# Altium schematic sheet UART.SchDoc: Air724UG 参考设计
size 594 x 419 mm; DESIGNER: Loukanghua; REV: V1.0
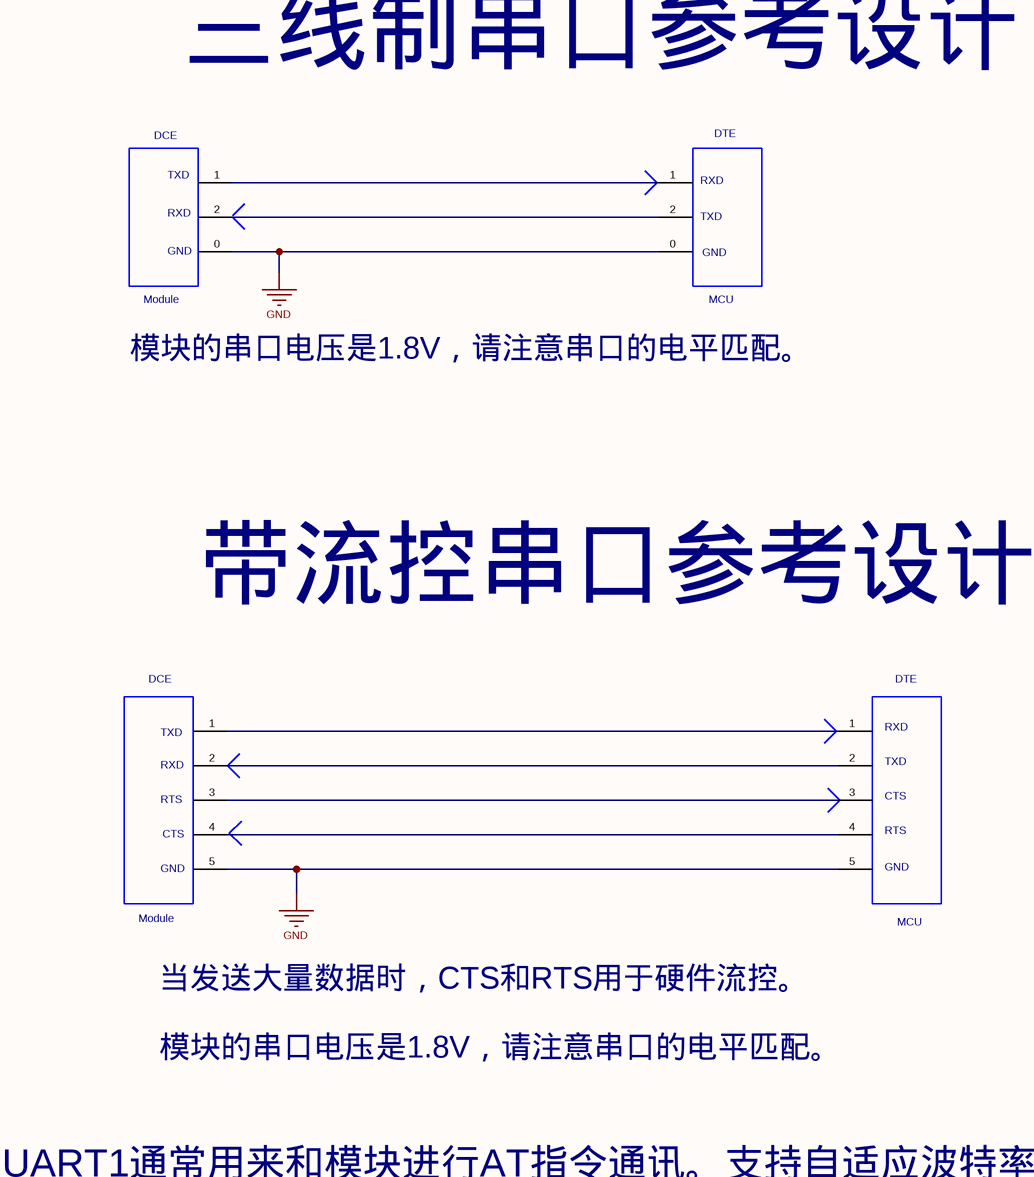
[diagram p0: UART.SchDoc, top left]
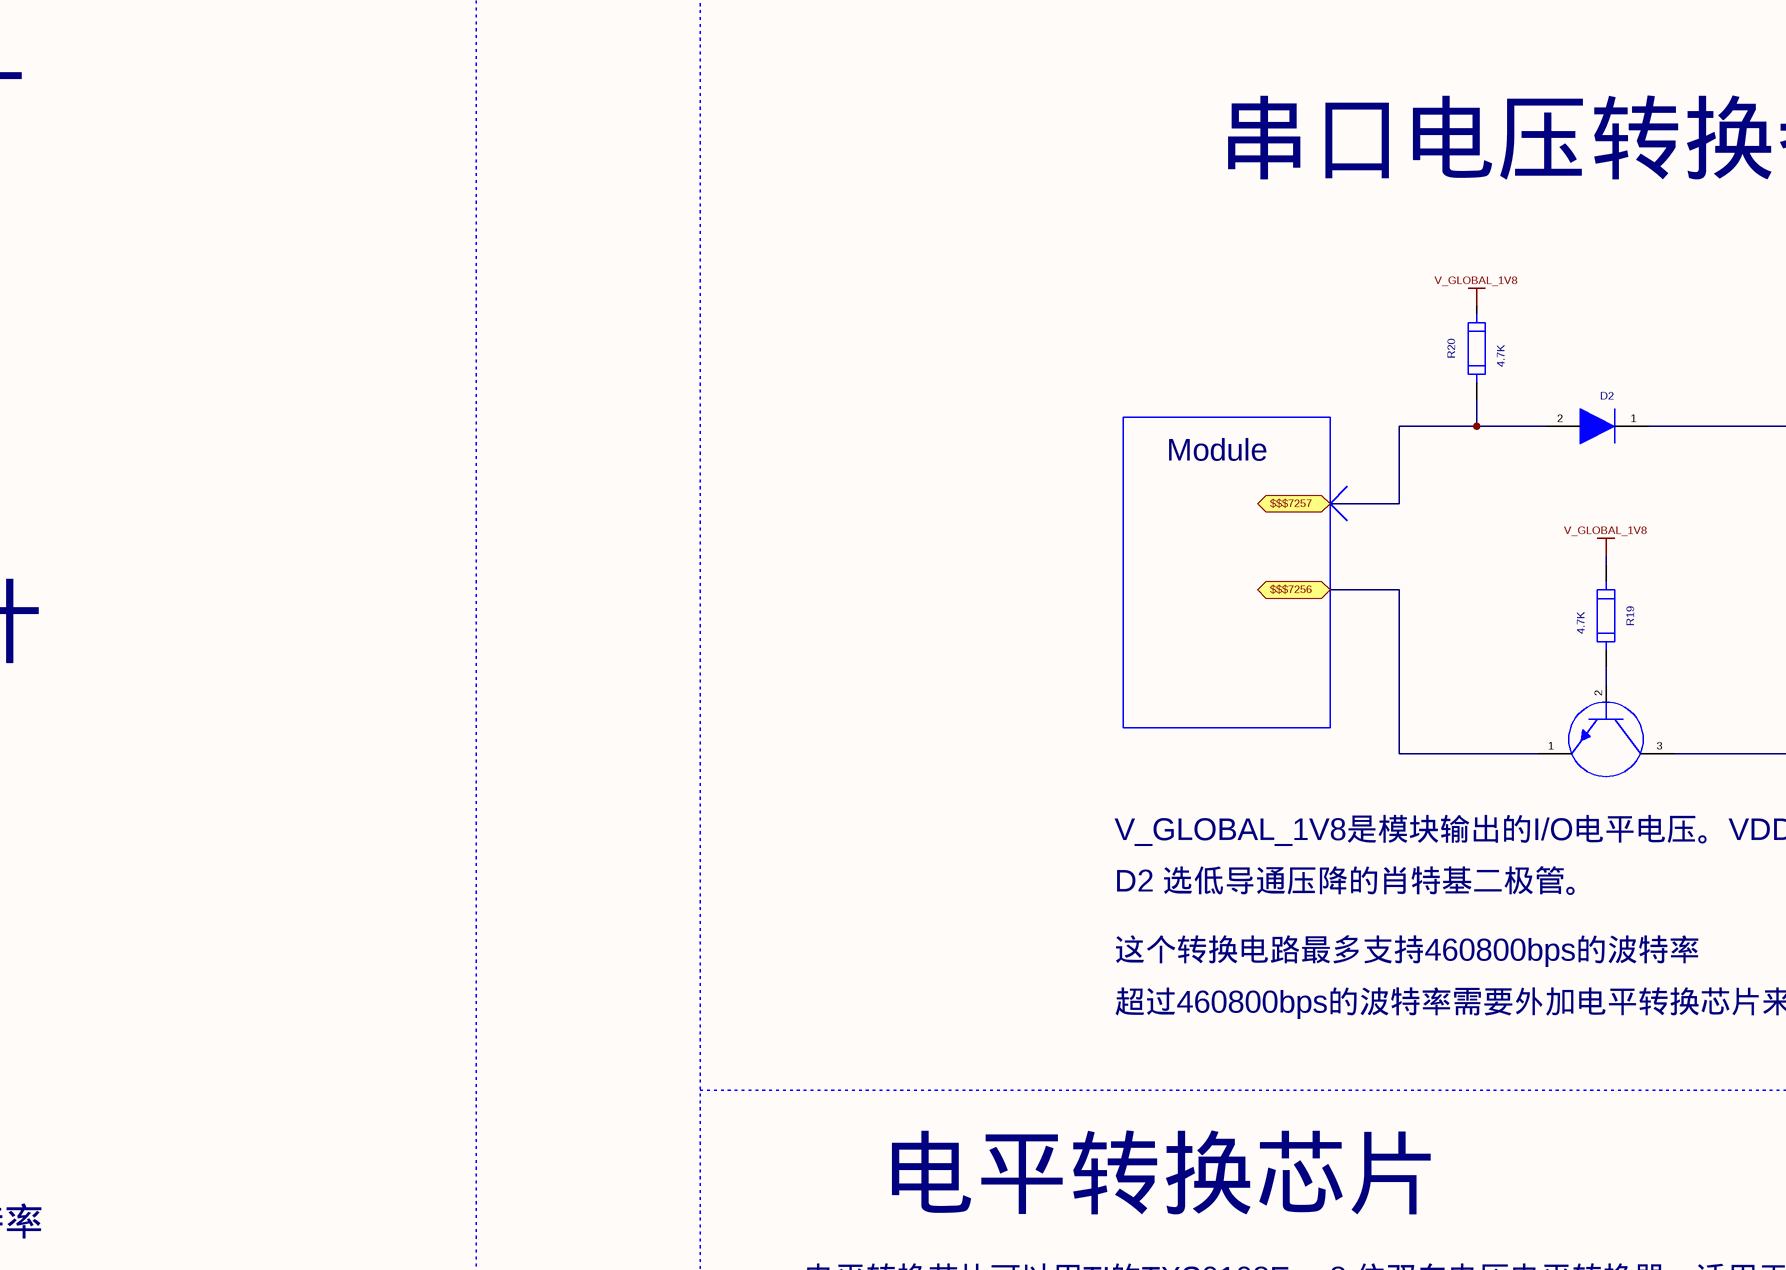
[diagram p1: UART.SchDoc, top middle]
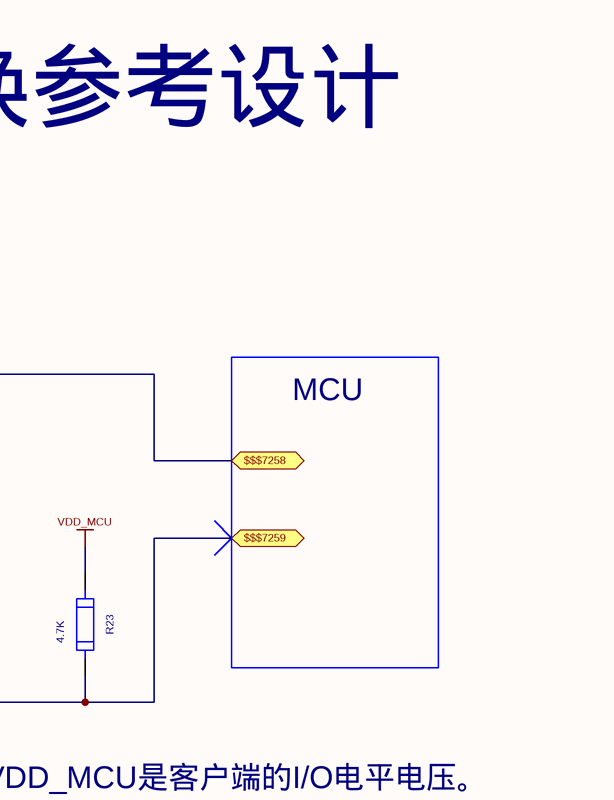
[diagram p2: UART.SchDoc, top right]
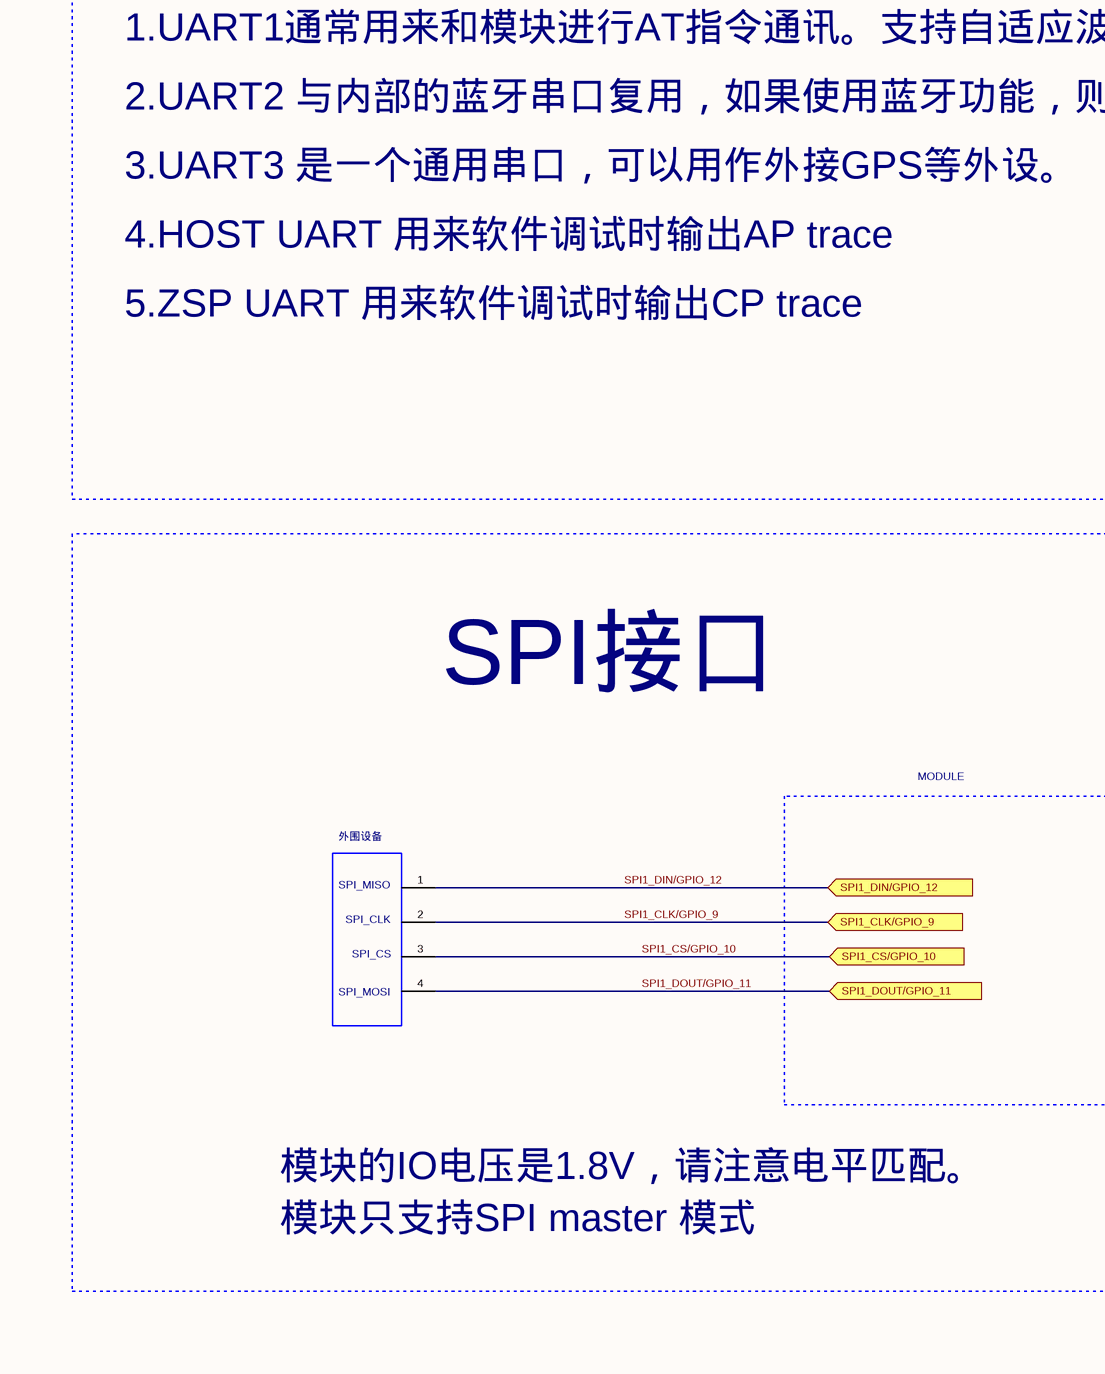
[diagram p3: UART.SchDoc, bottom left]
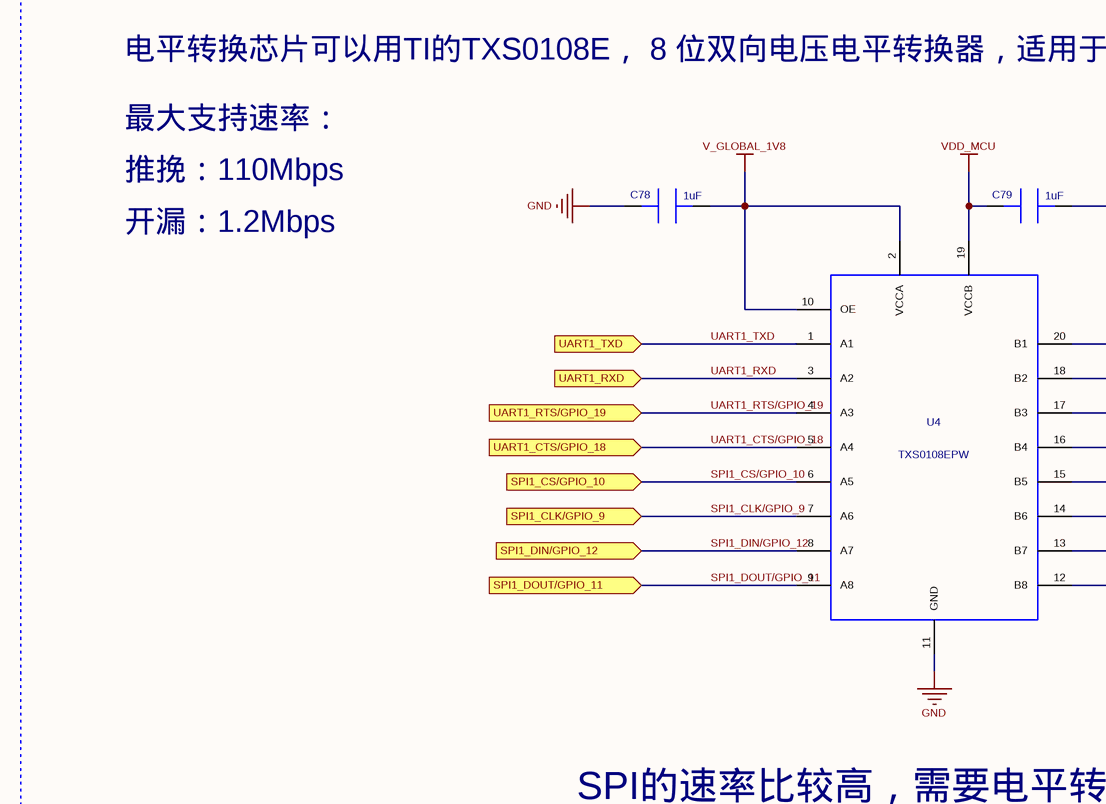
[diagram p4: UART.SchDoc, bottom middle]
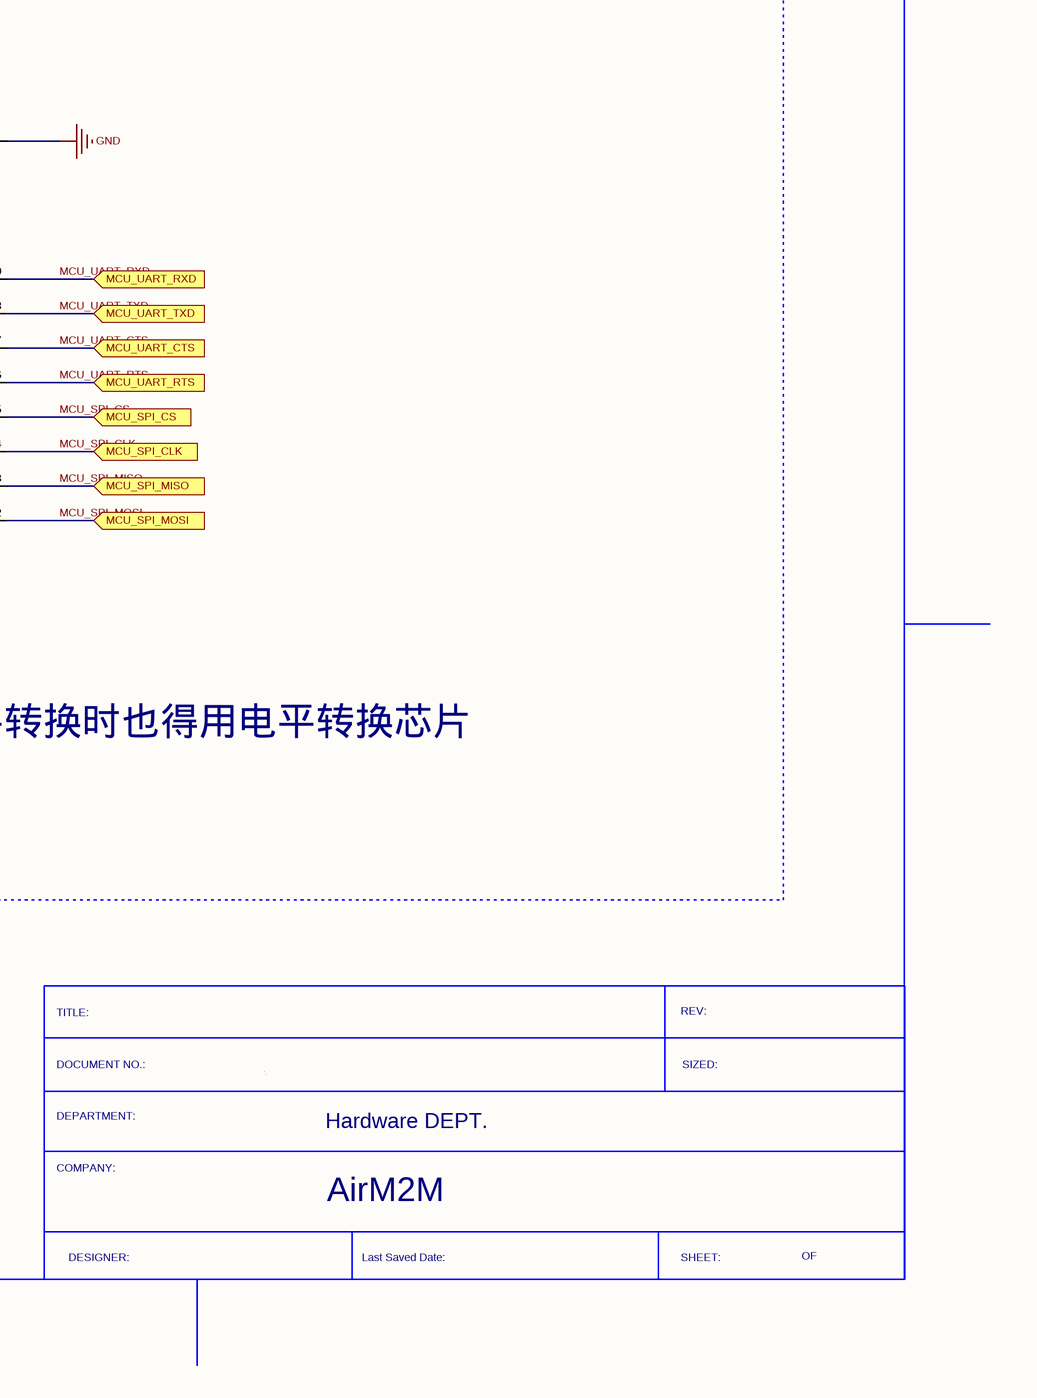
[diagram p5: UART.SchDoc, bottom right]

## Parts
C78  value 1uF  [SC0402]  (hidden comment: CAP-1UF-0402-X5R)
C79  value 1uF  [SC0402]  (hidden comment: CAP-1UF-0402-X5R)
D2  DIODE-SCHOTTKY-RB521S-30  [SOD523(RB521S)]  (value not drawn)
J27  DIP3X1  [DIP2X1-2.54]  (value not drawn)
J28  DIP3X1  [DIP2X1-2.54]  (value not drawn)
J29  DIP5X1  [DIP2X1-2.54]  (value not drawn)
J30  DIP5X1  [DIP2X1-2.54]  (value not drawn)
J33  DIP4X1  [DIP2X1-2.54]  (value not drawn)
Q4  TRIODE-NPN-2SC3356  [3PIN-2SC3356]  (value not drawn)
R19  value 4.7K  [SR0402]  (hidden comment: RES-4.7K-0402)
R20  value 4.7K  [SR0402]  (hidden comment: RES-4.7K-0402)
R23  value 4.7K  [SR0402]  (hidden comment: RES-4.7K-0402)
U4  TXS0108EPW

## Blocks framed on the sheet
SPI接口: J33

## Ports
$$$7256 (bidir), $$$7257 (bidir), $$$7258 (bidir), $$$7259 (bidir), MCU_SPI_CLK, MCU_SPI_CS, MCU_SPI_MISO, MCU_SPI_MOSI, MCU_UART_CTS, MCU_UART_RTS, MCU_UART_RXD, MCU_UART_TXD, SPI1_CLK/GPIO_9, SPI1_CS/GPIO_10, SPI1_DIN/GPIO_12, SPI1_DIN/GPIO_12 (in), SPI1_DOUT/GPIO_11, UART1_CTS/GPIO_18, UART1_RTS/GPIO_19, UART1_RXD, UART1_TXD

## Nets
GND: C78.1 C79.2 J27.0 J28.0 J29.5 J30.5 U4.11(GND)
V_GLOBAL_1V8: C78.2 R19.2 R20.2 U4.2(VCCA) U4.10(OE)
VDD_MCU: C79.1 R23.2 U4.19(VCCB)
$$$7256: Q4.1 ; port $$$7256
$$$7257: D2.2 R20.1 ; port $$$7257
$$$7258: D2.1 ; port $$$7258
$$$7259: Q4.3 R23.1 ; port $$$7259
MCU_SPI_CLK: U4.14(B6) ; port MCU_SPI_CLK
MCU_SPI_CS: U4.15(B5) ; port MCU_SPI_CS
MCU_SPI_MISO: U4.13(B7) ; port MCU_SPI_MISO
MCU_SPI_MOSI: U4.12(B8) ; port MCU_SPI_MOSI
MCU_UART_CTS: U4.17(B3) ; port MCU_UART_CTS
MCU_UART_RTS: U4.16(B4) ; port MCU_UART_RTS
MCU_UART_RXD: U4.20(B1) ; port MCU_UART_RXD
MCU_UART_TXD: U4.18(B2) ; port MCU_UART_TXD
SPI1_CLK/GPIO_9: J33.2 U4.7(A6) ; port SPI1_CLK/GPIO_9
SPI1_CS/GPIO_10: J33.3 U4.6(A5) ; port SPI1_CS/GPIO_10
SPI1_DIN/GPIO_12: J33.1 U4.8(A7) ; port SPI1_DIN/GPIO_12
SPI1_DOUT/GPIO_11: J33.4 U4.9(A8) ; port SPI1_DOUT/GPIO_11
UART1_CTS/GPIO_18: U4.5(A4) ; port UART1_CTS/GPIO_18
UART1_RTS/GPIO_19: U4.4(A3) ; port UART1_RTS/GPIO_19
UART1_RXD: U4.3(A2) ; port UART1_RXD
UART1_TXD: U4.1(A1) ; port UART1_TXD
NetJ27_1: J27.1 J28.1
NetJ27_2: J27.2 J28.2
NetJ29_1: J29.1 J30.1
NetJ29_2: J29.2 J30.2
NetJ29_3: J29.3 J30.3
NetJ29_4: J29.4 J30.4
NetQ4_2: Q4.2 R19.1

## Notes on the sheet
- (near J27) DTE
- 三线制串口参考设计
- 串口电压转换参考设计
- (near J28) DCE
- (near J28) TXD
- (near J28) RXD
- (near J27) RXD
- (near J27) TXD
- (near J28) Module
- (near J28) GND
- (near J27) GND
- (near J27) MCU
- 模块的串口电压是1.8V，请注意串口的电平匹配。
- MCU
- Module
- RXD
- TXD
- 带流控串口参考设计
- (near J29) DCE
- (near J29) TXD
- (near J30) RXD
- (near J30) DTE
- (near J29) RXD
- (near J29) RTS
- (near J30) TXD
- (near J30) CTS
- (near Q4) V_GLOBAL_1V8是模块输出的I/O电平电压。VDD_MCU是客户端的I/O电平电压。
- (near J29) GND
- (near J29) CTS
- (near J30) RTS
- (near J30) GND
- D2 选低导通压降的肖特基二极管。
- 这个转换电路最多支持460800bps的波特率
- (near J29) Module
- 当发送大量数据时，CTS和RTS用于硬件流控。
- (near J30) MCU
- 超过460800bps的波特率需要外加电平转换芯片来实现电压转换。
- 电平转换芯片
- 1.UART1通常用来和模块进行AT指令通讯。支持自适应波特率
- 2.UART2 与内部的蓝牙串口复用，如果使用蓝牙功能，则UART2 会被占用。
- 电平转换芯片可以用TI的TXS0108E， 8 位双向电压电平转换器，适用于漏极开路和推挽应用
- 3.UART3 是一个通用串口，可以用作外接GPS等外设。
- 最大支持速率：
- 4.HOST UART 用来软件调试时输出AP trace
- 推挽：110Mbps
- 开漏：1.2Mbps
- 5.ZSP UART 用来软件调试时输出CP trace
- MODULE
- (near J33) 外围设备
- (near J33) SPI_MISO
- SPI的速率比较高，需要电平转换时也得用电平转换芯片
- (near J33) SPI_CLK
- (near J33) SPI_CS
- (near J33) SPI_MOSI
- TITLE:
- REV:
- 模块只支持SPI master 模式
- 模块的IO电压是1.8V，请注意电平匹配。
- DEPARTMENT:
- DOCUMENT NO.:
- Hardware DEPT.
- SIZED:
- COMPANY:
- AirM2M
- DESIGNER:
- Last Saved Date:
- SHEET:
- OF

## Library data of the parts
C78 C79 = CAP-1UF-0402-X5R: CAP CER X5R;1uF;+/-10%;6.3V;0402;0.5mm;ROHS; Manufacture 1 P/N: GRM155R60J105K****;CC0402KRX5R5BB105;C1005X5R0J105KT;JMK105BJ105KV-F;ECJ0EB0J105K;0402X105K6R3CT;CL05A105KQ5NNNC; Manufacture 1: Murata;Yageo;TDK;Taiyo Yuden;Panasonic;Walsin;Samsung; Serial Number: 80214710001; Geometry.Height: 0.55mm; Tolerance: +/-10%; PCB DECAL: SC0402
D2 = DIODE-SCHOTTKY-RB521S-30: Schottky Diode;30V;200mA/0.6V;SOD-523;0.7mm;ROHS; Manufacture 1: Panjit;WILL;KEC;Onsemi;; Manufacture 1 P/N: RB521S30T1G;KDR730E;RB521S30-2/TR;RB521S30/TR; Serial Number: 81210000004; Geometry.Height: 0.7mm; PCB DECAL: SOD523(RB521S)
J27 J28 = DIP3X1: Geometry.Height: 2mm; PCB DECAL: DIP2X1-2.54
J29 J30 = DIP5X1: Geometry.Height: 2mm; PCB DECAL: DIP2X1-2.54
J33 = DIP4X1: Geometry.Height: 2mm; PCB DECAL: DIP2X1-2.54
Q4 = TRIODE-NPN-2SC3356: Silicon RF Transistor;NPN;12V;0.1A;3-PIN;1.4mm;ROHS; Manufacture 1: NEC; serial number: 81232000003; Geometry.Height: 1.4mm; Manufacture 1 P/N: 2SC3356; PCB DECAL: 3PIN-2SC3356
R19 R20 R23 = RES-4.7K-0402: RES FILM;4.7K;+/-5%;1/16W;0402;0.4mm;ROHS; Manufacture 1 P/N: RC0402JR-074K7L; Manufacture 1: YAGEO; Serial Number: 80114640017; Geometry.Height: 0.4mm; Tolerance: +/-5%; PCB DECAL: SR0402
U4 = TXS0108EPW: TXS0108E 8 位双向电压电平转换器，适用于漏极开路和推挽应用; Manufacture 1: TI; Manufacture 1 P/N: TXS0108EPW